# EAGLE design sensorboard_atm_rev0 (EAGLE 6.5.0)
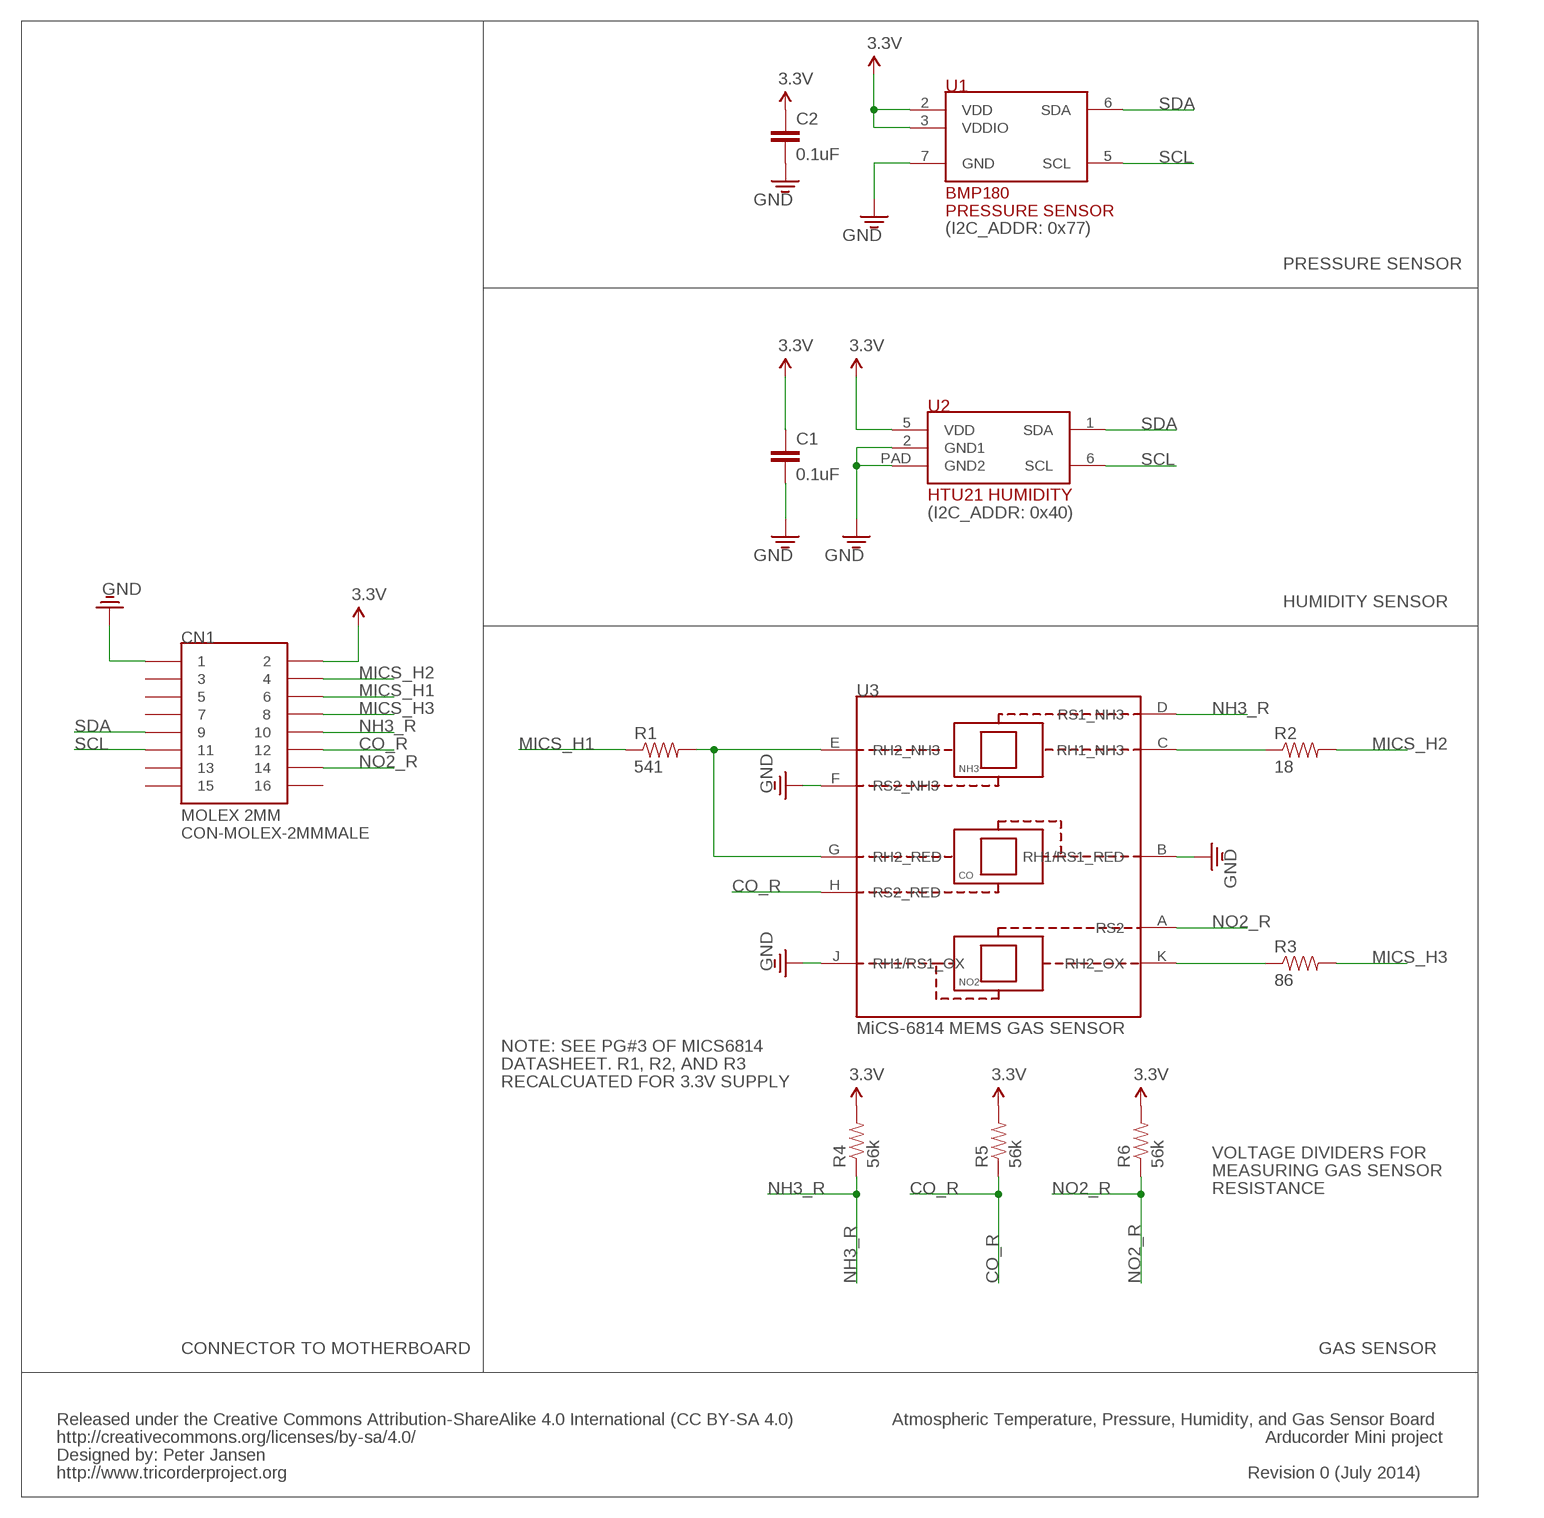
[diagram p0: schematic, sheet 1]

## Parts
C1  0.1uF  CAP0603  [0603]
C2  0.1uF  CAP0603  [0603]
CN1  CON-MOLEX-2MMMALE  [MOLEX-0877591650]
R1  541  RESISTOR0603  [0603]
R2  18  RESISTOR0603  [0603]
R3  86  RESISTOR0603  [0603]
R4  56k  RESISTOR0603  [0603]
R5  56k  RESISTOR0603  [0603]
R6  56k  RESISTOR0603  [0603]
U1  BMP180  [BMP180]
U2  HTU21D  [HTU21D]
U3  MICS-6814  [MICS-6814]

## Nets
3.3V: C1.1 C2.1 CN1.2 R4.2 R5.2 R6.2 U1.2(VDD) U1.3(VDDIO) U2.5(VDD)
CO_R: CN1.12 R5.1 U3.H(RS2_RED)
GND: C1.2 C2.2 CN1.1 U1.7(GND) U2.2(GND1) U2.PAD(GND2) U3.B(RH1/RS1_RED) U3.F(RS2_NH3) U3.J(RH1/RS1_OX)
MICS_H1: CN1.6 R1.1
MICS_H2: CN1.4 R2.2
MICS_H3: CN1.8 R3.2
N$19: R1.2 U3.E(RH2_NH3) U3.G(RH2_RED)
N$24: R2.1 U3.C(RH1_NH3)
N$25: R3.1 U3.K(RH2_OX)
NH3_R: CN1.10 R4.1 U3.D(RS1_NH3)
NO2_R: CN1.14 R6.1 U3.A(RS2)
SCL: CN1.11 U1.5(SCL) U2.6(SCL)
SDA: CN1.9 U1.6(SDA) U2.1(SDA)
Unconnected: CN1.3 CN1.5 CN1.7 CN1.13 CN1.15 CN1.16

## Notes on the sheet
- (I2C_ADDR: 0x77)
- PRESSURE SENSOR
- (I2C_ADDR: 0x40)
- HUMIDITY SENSOR
- NOTE: SEE PG#3 OF MICS6814
- DATASHEET. R1, R2, AND R3
- RECALCUATED FOR 3.3V SUPPLY
- VOLTAGE DIVIDERS FOR
- MEASURING GAS SENSOR
- RESISTANCE
- CONNECTOR TO MOTHERBOARD | GAS SENSOR
- Released under the Creative Commons Attribution-ShareAlike 4.0 International (CC BY-SA 4.0) | Atmospheric Temperature, Pressure, Humidity, and Gas Sensor Board
- http://creativecommons.org/licenses/by-sa/4.0/ | Arducorder Mini project
- Designed by: Peter Jansen
- http://www.tricorderproject.org | Revision 0 (July 2014)

## Library data of the parts
C1 C2 = notes_mark5a:CAP: Capacitor Standard 0603 ceramic capacitor, and 0.1" leaded capacitor.
CN1 = notes-arducorder-mini:CON-MOLEX-2MM: Molex 2mm pitch connectors. (87368-1624, 0877591650)
R1-R6 = notes_mark5a:RESISTOR: Resistor Basic schematic elements and footprints for 0603, 1206, and PTH 1/10th watt (small) resistors.
U1 = notes_mark5a:BMP180: BMP180 Digital Pressure Sensor w/I2C interface
U2 = notes_mark5a:HTU21D: HTU21D Relative Humidity Sensor w/I2C interface
U3 = notes_mark5a:MICS-6814: SGX SensorTech MiCS-6814 MEMS Gas Sensor w/3 Indepedent Sensing Elements

## Net classes
1 supply: width 0.178 mm
3 usbvcc: width 0.61 mm, drill 0.508 mm, clearance 0.203 mm to class 0, clearance 0.254 mm
5 USB: width 0.14 mm

## Board
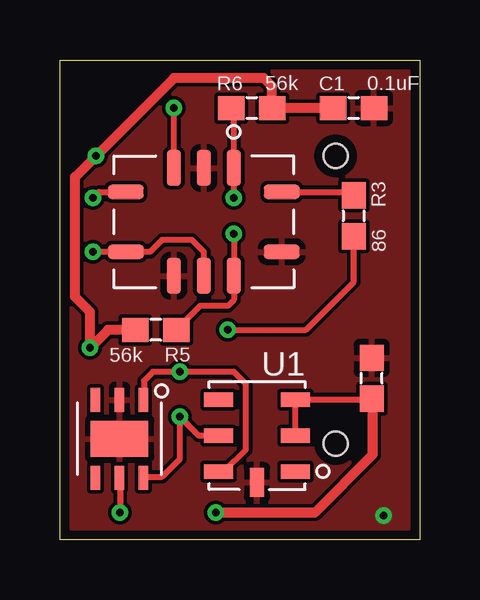
[diagram p1: board, top side]
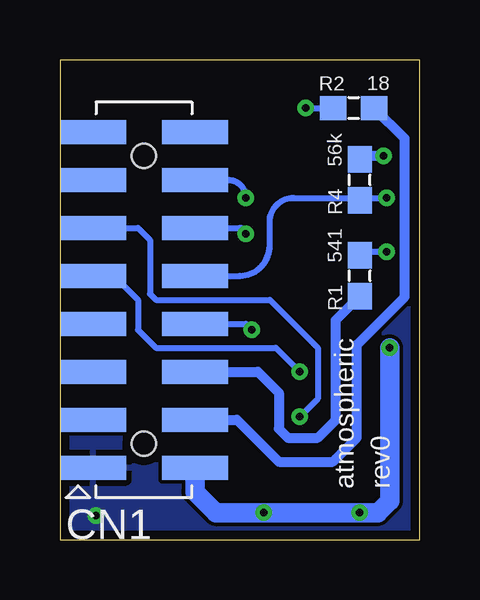
[diagram p2: board, bottom side, seen from below]

Size 15 x 20 mm. Coordinates in mm from the lower left corner, seen from the top.
Outline: 15,20 15,0 0,0 0,20 15,20
Copper layers (1*16): Top 0.0356mm / dielectric 1.5011mm / Bottom 0.0356mm
Design rules "default": minimum track width 6mil, minimum drill 13mil, track to track 6mil, track to pad 6mil, pad to pad 6mil, via to via 6mil, smd to smd 6mil, copper to edge 15mil, drill to drill 6mil, minimum pad ring 7mil, minimum via ring 7mil, stop-mask expansion 3mil, vias tented up to drill 0mil, thermal gap 10mil
tRestrict: area 92.5,48.5 to 94.5,54.5; area 90.5,36 to 94.5,44
bRestrict: area 92.5,47.5 to 94.5,55.5; area 90.5,34 to 94.5,46

### Footprints (pad centres in the part's own frame; a part is rotated, then mirrored left to right if it is on the bottom)
0603 = smd 1.1 x 1: 1 -0.85,0; 2 0.85,0
MOLEX-0877591650 = smd 1 x 2.75: 1 7,-2.125; 2 7,2.125; 3 5,-2.125; 4 5,2.125; 5 3,-2.125; 6 3,2.125; 7 1,-2.125; 8 1,2.125; 9 -1,-2.125; 10 -1,2.125; 11 -3,-2.125; 12 -3,2.125; 13 -5,-2.125; 14 -5,2.125; 15 -7,-2.125; 16 -7,2.125 | hole 1: -6,0; 6,0
BMP180 = smd 0.6 x 1.2: 1 -1.5,-1.6; 2 0,-1.6; 3 1.5,-1.6; 4 1.5,1.6; 5 0,1.6; 6 -1.5,1.6 | smd 1.2 x 0.6: 7 -1.95,0
HTU21D = smd 1 x 0.4: 1 1.625,-1; 2 1.625,0; 3 1.625,1; 4 -1.625,1; 5 -1.625,0; 6 -1.625,-1 | smd 1.5 x 2.4: PAD 0,0
MICS-6814 = smd 1.5 x 0.6: A 2.25,-1.25; B 2.25,0; C 2.25,1.25; F -2.25,1.25; G -2.25,0; H -2.25,-1.25 | smd 0.6 x 1.5: D 1.25,3.25; E -1.25,3.25; J -1.25,-3.25; K 1.25,-3.25

### Placement (x,y rotation side)
C1  12.25,18 0 top
C2  13,6.72 90 top
CN1  11.5,10 270 bottom
R1  2.5,11 90 bottom
R2  2.75,18 0 bottom
R3  12.25,13.5 270 top
R4  2.5,15 90 bottom
R5  4,8.75 180 top
R6  8,18 0 top
U1  8.22,4.34 90 top
U2  2.49,4.21 90 top
U3  6,13.25 90 top

### Tracks (layer width: path | path; a pad name or v marks a point on that pad's centre or on a via)
3.3V  (via drill 0.33)
  Top 0.254: 13.04,5.84 C2.1 12.96,5.84 U1.3 U1.2 | U2.5 2.5,2.57 v2.5,1.12
  Top 0.406: C1.1 R6.2 8.85,18.9 8.5,19.25 4.75,19.25 v1.5,16 0.62,15.12 0.62,10.12 1.25,9.5 v1.25,8 2,8.75 R5.2 | 13.04,5.84 13.04,3.54 10.62,1.12 v6.5,1.12
  Bottom 0.406: v1.5,16 2.35,16 R4.2
  Bottom 0.813: CN1.2 9.38,2 8.5,1.12 v6.5,1.12 v2.5,1.12 1.75,1.12 1.25,1.62 v1.25,8
CO_R  (via drill 0.33)
  Top 0.254: v7.25,12.75 U3.H 7.25,10 7,9.75 5.85,9.75 R5.1
  Bottom 0.254: CN1.12 7.5,13 arc90 v7.25,12.75
GND  (via drill 0.33)
  other vias: 13.5,1
  pour Bottom: 15,20 15,0 0,0 0,20
  pour Top: 0,20 15,20 15,0 0,0
MICS_H1
  Bottom 0.406: CN1.6 6.75,7 5.88,6.12 5.88,4.62 5.5,4.25 4.25,4.25 3.5,5 3.5,9.15 R1.1
MICS_H2
  Bottom 0.406: CN1.4 7.62,5 5.88,3.25 3.62,3.25 2.62,4.25 2.62,8.12 0.62,10.12 0.62,16.73 R2.2
MICS_H3  (via drill 0.33)
  Top 0.254: v7,8.75 10.25,8.75 12.25,10.75 R3.2
  Bottom 0.254: CN1.8 7.25,9 v7,8.75
N$19  (via drill 0.33)
  Top 0.254: v1.38,12 U3.E 3.75,12 4.25,12.5 5.5,12.5 6,12 U3.G
  Bottom 0.254: v1.38,12 2.35,12 R1.2
N$24  (via drill 0.33)
  Top 0.254: U3.C v4.75,18
  Bottom 0.254: v4.75,18 R2.1
N$25
  Top 0.254: U3.K 12.1,14.5 R3.1
NH3_R  (via drill 0.33)
  Top 0.254: v1.38,14.25 1.62,14.5 U3.D
  Bottom 0.254: CN1.10 7.5,11 arc-90 6.25,12.25 6.25,13.25 arc90 5.25,14.25 2.6,14.25 | 2.6,14.25 arc90 R4.1 | 2.6,14.25 v1.38,14.25
NO2_R  (via drill 0.33)
  Top 0.254: R6.1 arc-90 7.25,17.9 7.25,16.25 U3.A v7.25,14.25
  Bottom 0.254: CN1.14 8,15 arc90 v7.25,14.25
SCL  (via drill 0.33)
  Top 0.254: U1.5 5.79,4.34 v5,5.12 5,3.38 4.25,2.62 3.53,2.62 U2.6
  Bottom 0.254: CN1.11 11.75,13 11.25,12.5 11.25,10.25 11,10 6.25,10 4.25,8 4.25,5.88 v5,5.12
SDA  (via drill 0.33)
  Top 0.254: U2.1 3.5,5.85 3.5,6.62 3.88,7 v5,7 7.25,7 7.75,6.5 7.75,3.75 6.84,2.84 U1.6
  Bottom 0.254: CN1.9 12.75,11 11.75,10 11.75,8.75 11,8 6,8 v5,7

### Text on the board
bPlace: rev0 | atmospheric